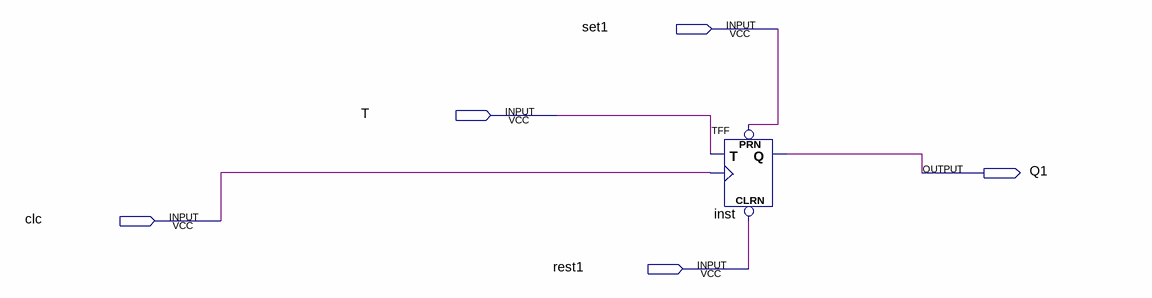
[diagram p0: schematic sheet]
// Quartus schematic Block2.bdf as structural Verilog: 1 symbols, 5 pins
module Block2 (
  input  set1,
  input  T,
  input  clc,
  input  rest1,
  output Q1
);

  TFF inst (.PRN(set1), .CLRN(rest1), .T(T), .CLK(clc), .Q(Q1));
endmodule
